# EAGLE design Offsetboard (EAGLE 6.6.0)
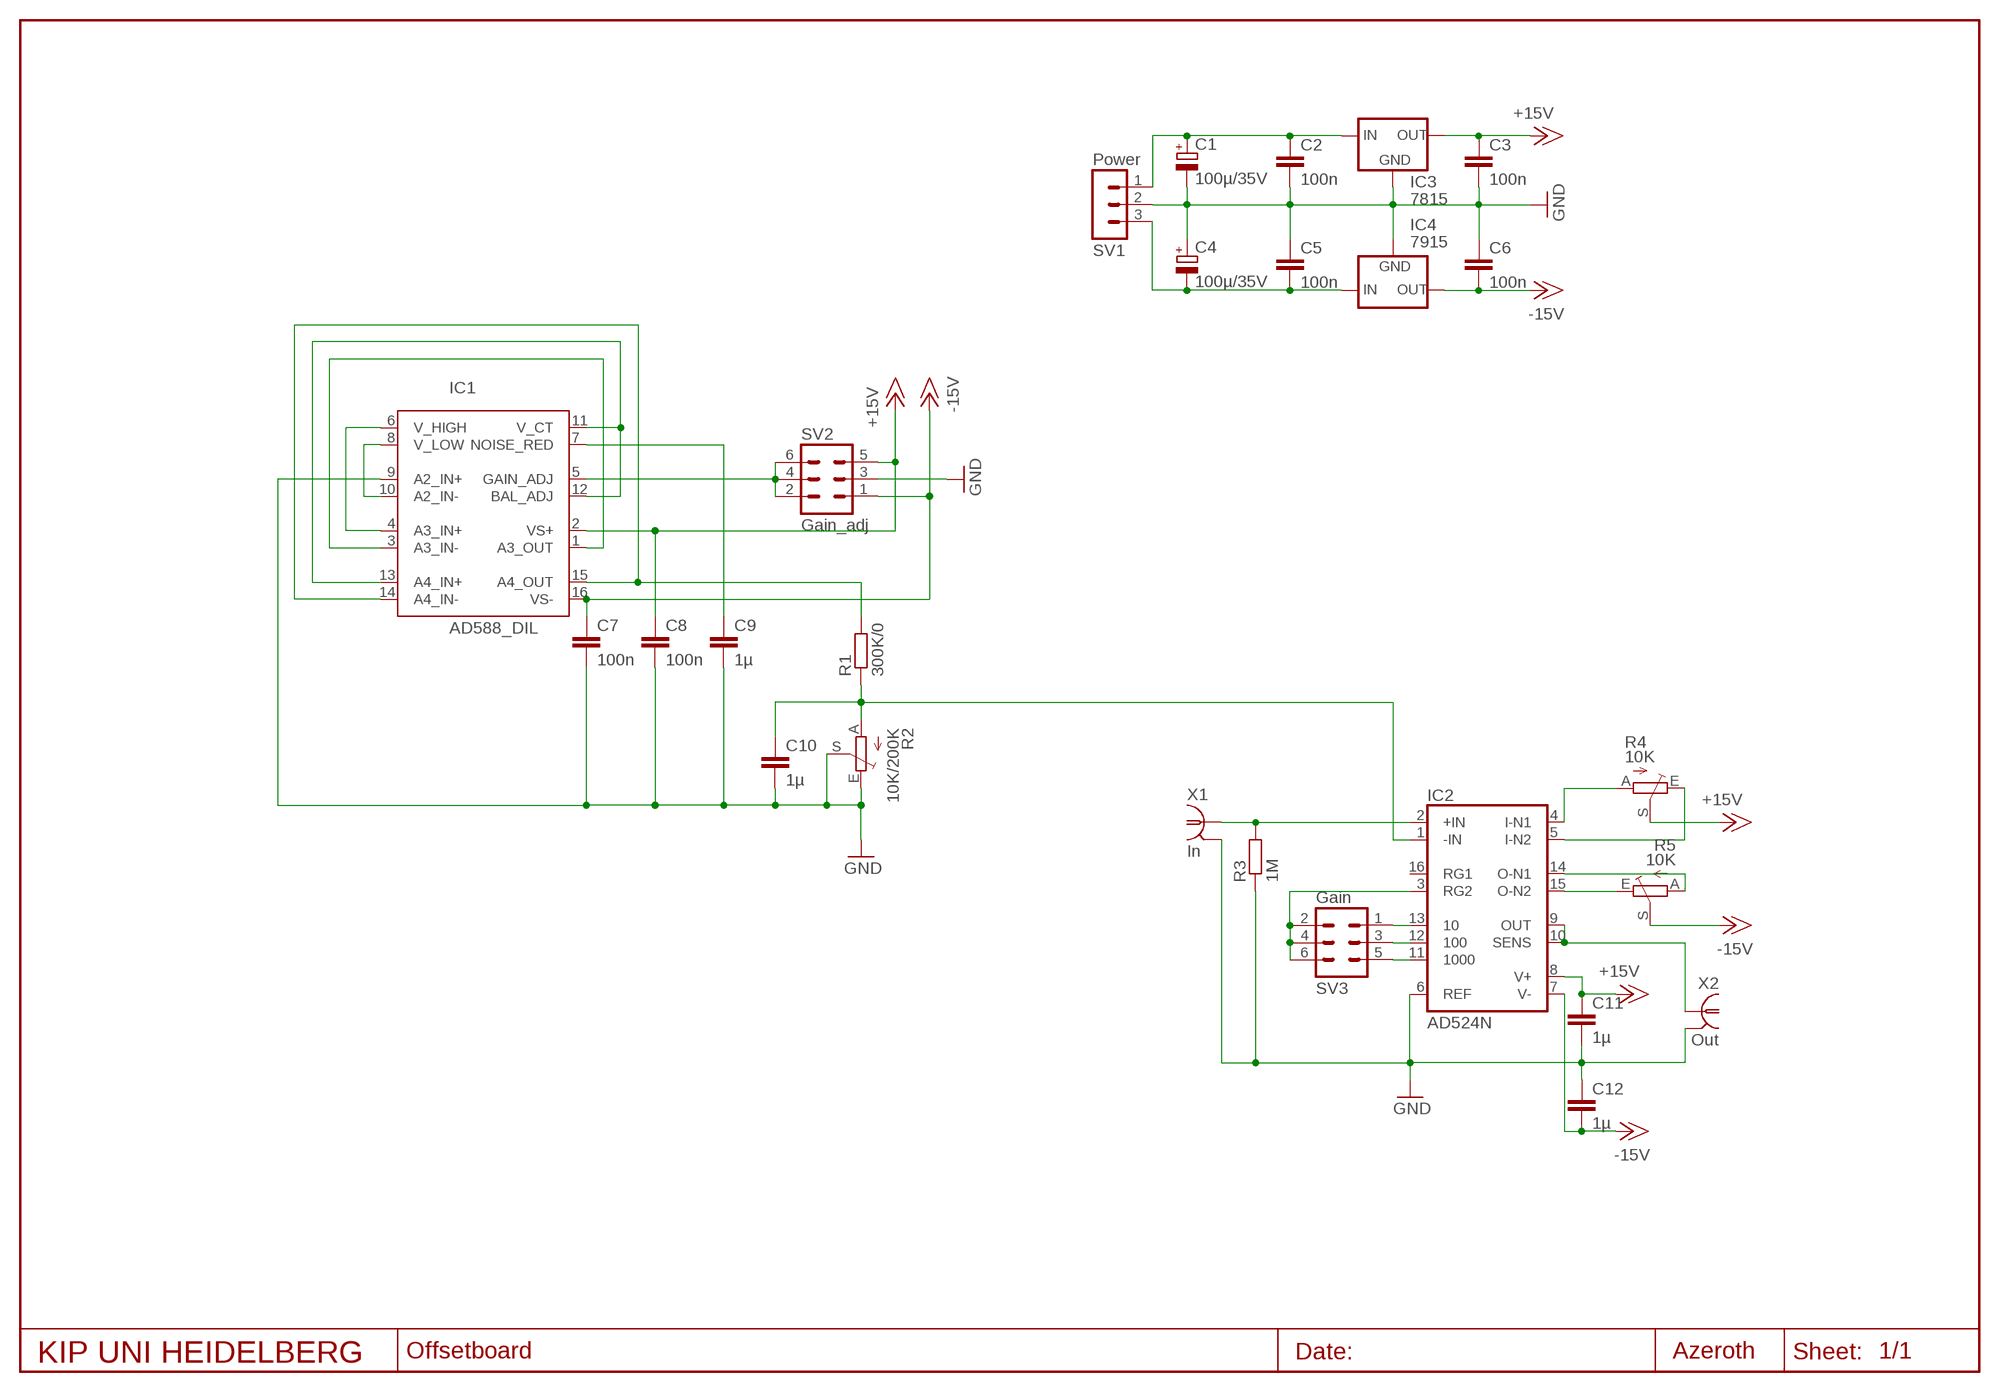
[diagram p0: schematic, sheet 1]

## Parts
C1  100µ/35V  CPOL-EUE2.5-6  [E2,5-6]
C2  100n  C-EUC1206K  [C1206K]
C3  100n  C-EUC1206K  [C1206K]
C4  100µ/35V  CPOL-EUE2.5-6  [E2,5-6]
C5  100n  C-EUC1206K  [C1206K]
C6  100n  C-EUC1206K  [C1206K]
C7  100n  C-EUC1206K  [C1206K]
C8  100n  C-EUC1206K  [C1206K]
C9  1µ  C-EUC1206K  [C1206K]
C10  1µ  C-EUC1206K  [C1206K]
C11  1µ  C-EUC1206K  [C1206K]
C12  1µ  C-EUC1206K  [C1206K]
IC1  AD588_DIL  [DIL16]
IC2  AD524N  [DIL16]
IC3  7815  78MXXS  [78MXXS]
IC4  7915  79XXS  [79XXS]
R1  300K/0  R-EU_0207/10  [0207/10]
R2  10K/200K  TRIM_EU-S64W  [S64W]
R3  1M  R-EU_0207/10  [0207/10]
R4  10K  TRIM_EU-S64W  [S64W]
R5  10K  TRIM_EU-S64W  [S64W]
SV1  Power  MA03-1  [MA03-1]
SV2  Gain_adj  MA03-2  [MA03-2]
SV3  Gain  MA03-2  [MA03-2]
X1  In  1-227161-0  [AMP_227161]
X2  Out  1-227161-0  [AMP_227161]

## Nets
+15V: C3.1 C8.1 C11.1 IC1.2(VS+) IC2.8(V+) IC3.OUT R4.S SV2.5
-15V: C6.2 C7.1 C12.2 IC1.16(VS-) IC2.7(V-) IC4.OUT R5.S SV2.1
GND: C1.- C2.2 C3.2 C4.+ C5.1 C6.1 C7.2 C8.2 C9.2 C10.2 C11.2 C12.1 IC1.9(A2_IN+) IC2.6(REF) IC3.GND IC4.GND R2.E R2.S R3.1 SV1.2 SV2.3 X1.2(GND) X2.2(GND)
N$1: IC2.4(I-N1) R4.A
N$2: IC2.15(O-N2) R5.E
N$3: IC2.14(O-N1) R5.A
N$4: IC2.5(I-N2) R4.E
N$5: IC2.2(+IN) R3.2 X1.1
N$6: IC2.13 SV3.1
N$7: IC2.12 SV3.3
N$8: IC2.11 SV3.5
N$9: IC2.3(RG2) SV3.2 SV3.4 SV3.6
N$10: IC2.9(OUT) IC2.10(SENS) X2.1
N$11: IC1.14(A4_IN-) IC1.15(A4_OUT) R1.2
N$12: C10.1 IC2.1(-IN) R1.1 R2.A
N$13: IC1.1(A3_OUT) IC1.3(A3_IN-)
N$14: IC1.4(A3_IN+) IC1.6(V_HIGH)
N$15: C9.1 IC1.7(NOISE_RED)
N$16: IC1.8(V_LOW) IC1.10(A2_IN-)
N$17: IC1.11(V_CT) IC1.12(BAL_ADJ) IC1.13(A4_IN+)
N$18: C4.- C5.2 IC4.IN SV1.3
N$20: IC1.5(GAIN_ADJ) SV2.2 SV2.4 SV2.6
N$21: C1.+ C2.1 IC3.IN SV1.1
Unconnected: IC2.16(RG1)

## Library data of the parts
C1 C4 = rcl:CPOL-EU: POLARIZED CAPACITOR, European symbol
C2 C3 C5-C12 = rcl:C-EU: CAPACITOR, European symbol
IC1 = userAze:AD588
IC2 = linear:AD524: OP AMP
IC3 = v-reg:78MXXS: VOLTAGE REGULATOR
IC4 = v-reg:79XXS: VOLTAGE REGULATOR
R1 R3 = rcl:R-EU_: RESISTOR, European symbol
R2 R4 R5 = pot:TRIM_EU-: POTENTIOMETER
SV1 = con-lstb:MA03-1: PIN HEADER; OC_FARNELL: unknown; OC_NEWARK: unknown
SV2 SV3 = con-lstb:MA03-2: PIN HEADER; OC_FARNELL: unknown; OC_NEWARK: unknown
X1 X2 = con-coax:?227161*: JACK, RIGHT ANGLE, 50 OHM, PCB, BNC Source: amp_227161.pdf; MF: TYCO ELECTRONICS; MPN: 1-227161; OC_FARNELL: unknown; OC_NEWARK: 33B3200

## Board
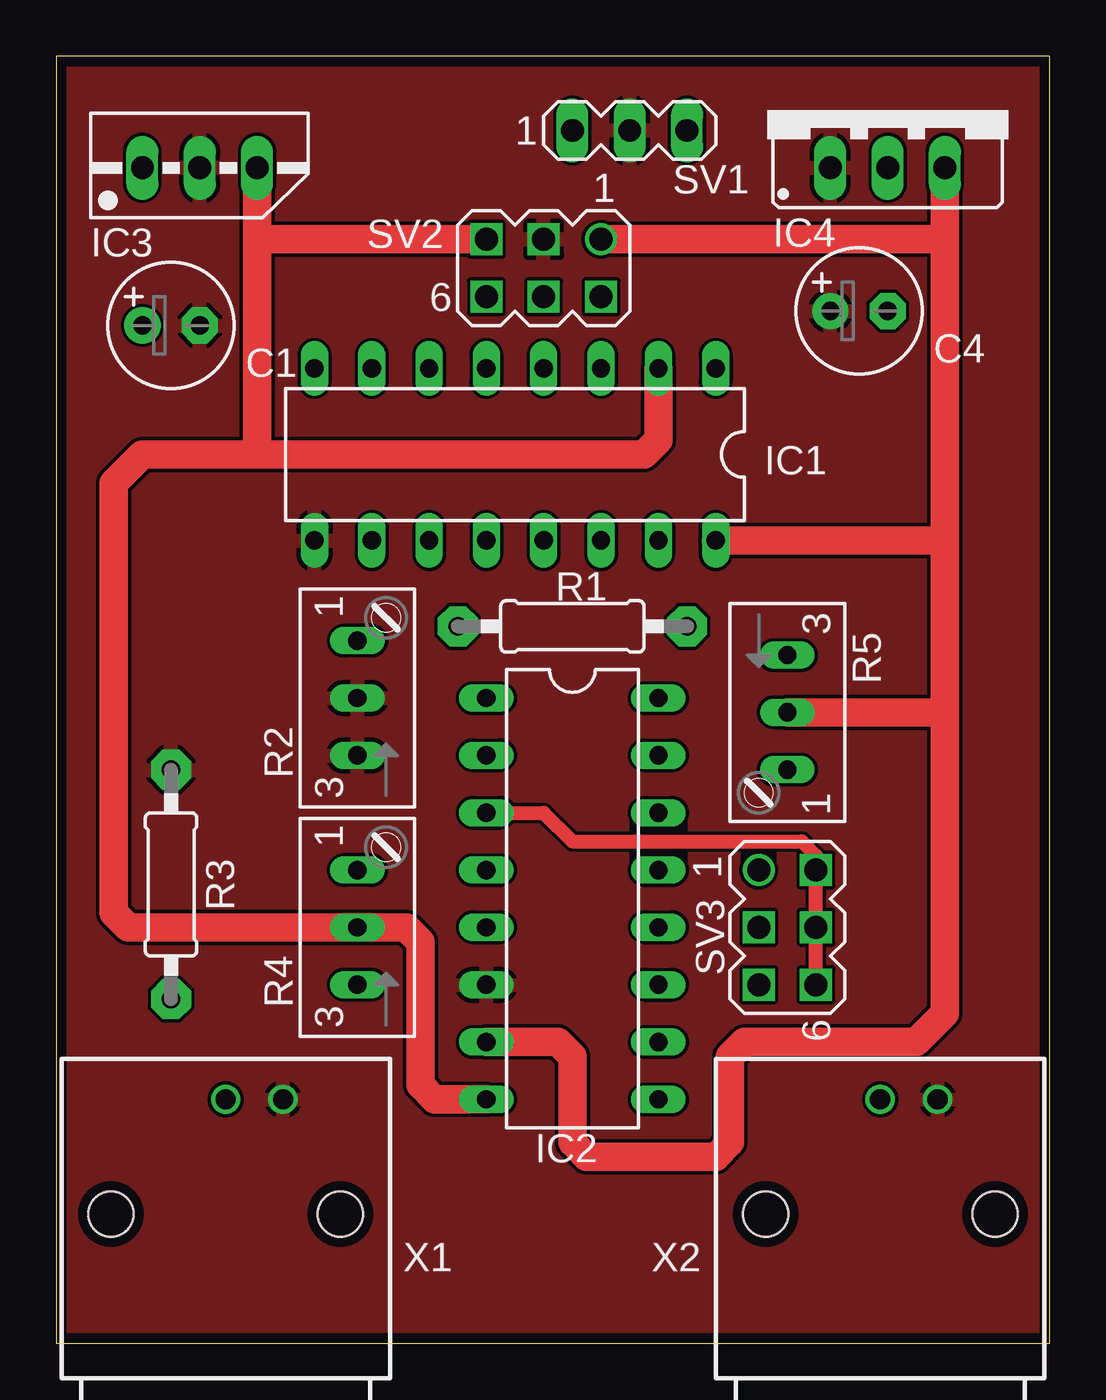
[diagram p1: board, top side]
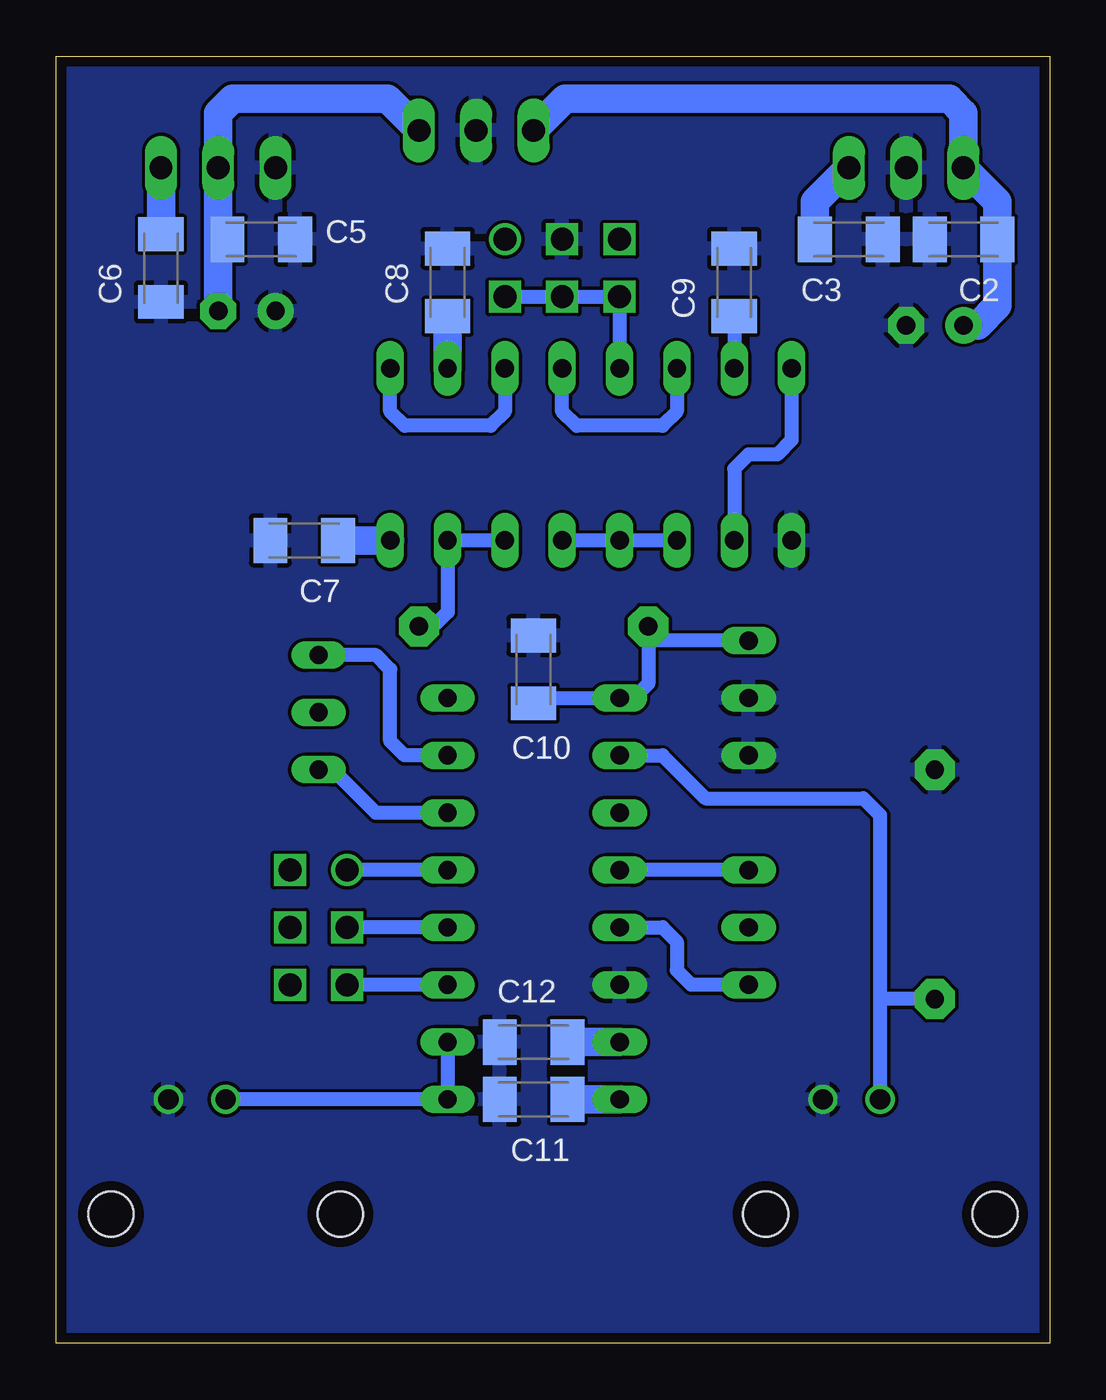
[diagram p2: board, bottom side, seen from below]

Size 44 x 57 mm. Coordinates in mm from the lower left corner, seen from the top.
Outline: 0,0 44,0 44,57 0,57 0,0
Copper layers (1*16): Top 0.018mm / dielectric 1.55mm / Bottom 0.018mm
Design rules "eC-STANDARD_pool-2-layer ": minimum track width 0.15mm, minimum drill 0.25mm, track to track 0.15mm, track to pad 0.15mm, pad to pad 0.15mm, via to via 0.15mm, smd to smd 0.15mm, copper to edge 0.45mm, drill to drill 0.3mm, minimum pad ring 0.2mm, minimum via ring 0.2mm, stop-mask expansion 0.1mm, vias tented up to drill 0mil, thermal gap 0.2mm

### Footprints (pad centres in the part's own frame; a part is rotated, then mirrored left to right if it is on the bottom)
E2,5-6 = drill 0.813 pad 1.6: + -1.27,0 | drill 0.813 pad 1.6 octagon: - 1.27,0
C1206K = smd 1.5 x 2: 1 -1.5,0; 2 1.5,0
DIL16 = drill 0.813 long: 1 -8.89,-3.81; 2 -6.35,-3.81; 3 -3.81,-3.81; 4 -1.27,-3.81; 5 1.27,-3.81; 6 3.81,-3.81; 7 6.35,-3.81; 8 8.89,-3.81; 9 8.89,3.81; 10 6.35,3.81; 11 3.81,3.81; 12 1.27,3.81; 13 -1.27,3.81; 14 -3.81,3.81; 15 -6.35,3.81; 16 -8.89,3.81
78MXXS = drill 1.016 long: GND 0,-2.54; IN -2.54,-2.54; OUT 2.54,-2.54
79XXS = drill 1.016 long: GND -2.54,-2.54; IN 0,-2.54; OUT 2.54,-2.54
0207/10 = drill 0.813 pad 1.778 octagon: 1 -5.08,0; 2 5.08,0
S64W = drill 0.813 long: A 2.54,1.27; E -2.54,1.27; S 0,1.27
MA03-1 = drill 1.016 long: 1 -2.54,0; 2 0,0; 3 2.54,0
MA03-2 = drill 1.016: 1 -2.54,-1.27 | drill 1.016 square: 2 -2.54,1.27; 3 0,-1.27; 4 0,1.27; 5 2.54,-1.27; 6 2.54,1.27
AMP_227161 = drill 0.9 pad 1.27: 1 0,-5.08; 2 -2.54,-5.08 | hole 2: -5.08,0; 5.08,0

### Placement (x,y rotation side)
C1  5.08,45.09 0 top
C2  3.81,48.9 180 bottom
C3  8.89,48.9 0 bottom
C4  35.56,45.72 0 top
C5  34.92,48.9 180 bottom
C6  39.37,47.62 90 bottom
C7  33.02,35.56 180 bottom
C8  26.67,46.99 90 bottom
C9  13.97,46.99 90 bottom
C10  22.86,29.84 90 bottom
C11  22.86,10.79 180 bottom
C12  22.86,13.34 0 bottom
IC1  20.32,39.37 180 top
IC2  22.86,19.68 270 top
IC3  6.35,54.61 0 top
IC4  36.83,54.61 0 top
R1  22.86,31.75 0 top
R2  14.61,28.57 90 top
R3  5.08,20.32 270 top
R4  14.61,18.41 90 top
R5  31.11,27.94 270 top
SV1  25.4,53.72 0 top
SV2  21.59,47.62 180 top
SV3  32.38,18.41 270 top
X1  7.5,5.71 180 top
X2  36.5,5.71 180 top

### Tracks (layer width: path | path; a pad name or v marks a point on that pad's centre or on a via)
+15V
  Top 1.27: 8.89,39.37 3.81,39.37 2.54,38.1 2.54,19.05 3.17,18.41 R4.S 15.49,18.41 16.13,17.78 16.13,11.43 16.76,10.79 IC2.8 | 8.89,39.37 8.89,48.9 | 8.89,48.9 IC3.OUT | SV2.5 8.89,48.9 | IC1.2 26.67,40.01 26.04,39.37 8.89,39.37
  Bottom 1.27: C3.1 10.39,50.57 IC3.OUT 9.53,51.44 | C11.1 IC2.8 | C8.1 IC1.2
-15V
  Top 1.27: IC4.OUT C6.2 | C6.2 39.37,35.56 | 39.37,35.56 39.37,27.94 | 39.37,27.94 39.37,14.61 38.1,13.34 30.48,13.34 29.84,12.7 29.84,8.89 29.21,8.26 23.5,8.26 22.86,8.89 22.86,12.7 22.23,13.34 IC2.7 | R5.S 39.37,27.94 | IC1.16 39.37,35.56 | SV2.1 39.14,48.9 C6.2
  Bottom 1.27: IC1.16 C7.1 | C6.2 IC4.OUT | C12.2 IC2.7
GND
  pour Bottom: -1.91,-3.17 48.26,-3.17 48.26,59.69 -1.91,59.69
  pour Top: -5.08,-5.71 -5.08,61.59 51.44,61.59 51.44,-5.71
N$1
  Bottom 0.61: R4.A IC2.4
N$2
  Bottom 0.61: IC2.15 28.57,26.04 29.21,26.67 29.21,29.84 29.84,30.48 R5.E
N$3
  Bottom 0.61: IC2.14 29.84,23.5 31.75,25.4 R5.A
N$4
  Bottom 0.61: R4.E 15.88,15.88 16.51,16.51 16.51,17.78 17.14,18.41 IC2.5
N$5
  Bottom 0.61: IC2.2 17.14,26.04 15.24,24.13 8.26,24.13 7.5,23.38 7.5,15.24 | X1.1 7.5,15.24 | R3.2 7.5,15.24
N$6
  Bottom 0.61: IC2.13 SV3.1
N$7
  Bottom 0.61: IC2.12 SV3.3
N$8
  Bottom 0.61: IC2.11 SV3.5
N$9
  Top 0.61: SV3.6 SV3.4 SV3.2 33.66,21.59 33.02,22.23 22.86,22.23 21.59,23.5 IC2.3
N$10
  Bottom 0.61: IC2.10 IC2.9 X2.1
N$11
  Bottom 0.61: IC1.14 IC1.15 26.67,32.38 27.3,31.75 R1.2
N$12
  Bottom 0.61: C10.1 22.63,28.57 IC2.1 18.41,28.57 17.78,29.21 17.78,31.11 | R1.1 17.78,31.11 | R2.A 17.78,31.11
N$13
  Bottom 0.61: IC1.3 24.13,41.27 24.77,40.64 28.57,40.64 29.21,41.27 IC1.1
N$14
  Bottom 0.61: IC1.6 16.51,41.27 17.14,40.64 20.95,40.64 21.59,41.27 IC1.4
N$15
  Bottom 0.61: C9.1 IC1.7
N$16
  Bottom 0.61: IC1.8 11.43,40.01 12.06,39.37 13.34,39.37 13.97,38.73 IC1.10
N$17
  Bottom 0.61: IC1.11 IC1.12 IC1.13
N$18
  Bottom 1.27: SV1.3 29.34,55.12 36.2,55.12 36.83,54.48 IC4.IN 36.83,48.9 | 36.83,48.9 C4.- | C5.2 36.83,48.9
N$20
  Bottom 0.61: SV2.2 SV2.4 SV2.6 IC1.5
N$21
  Bottom 1.27: C1.+ 3.17,45.09 2.31,45.95 C2.1 2.31,50.57 IC3.IN 3.81,54.48 4.45,55.12 21.46,55.12 SV1.1

### Text on the board
tValues: 10 / 100 / 1000